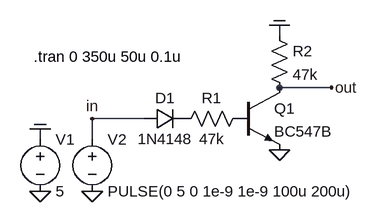
[diagram p0: schematic dtl1.asc]
dtl1.asc, the LTspice schematic file:
Version 4
SHEET 1 880 680
WIRE 464 16 464 0
WIRE 544 96 464 96
WIRE 256 144 176 144
WIRE 96 176 96 160
WIRE 176 176 176 144
FLAG 96 256 0
FLAG 96 160 COM
FLAG 464 192 0
FLAG 176 256 0
FLAG 464 0 COM
FLAG 544 96 out
FLAG 176 144 in
SYMBOL voltage 96 160 R0
WINDOW 123 0 0 Left 2
WINDOW 39 0 0 Left 2
SYMATTR InstName V1
SYMATTR Value 5
SYMBOL diode 256 160 R270
WINDOW 0 32 32 VTop 2
WINDOW 3 0 32 VBottom 2
SYMATTR InstName D1
SYMATTR Value 1N4148
SYMBOL res 416 128 R90
WINDOW 0 0 56 VBottom 2
WINDOW 3 32 56 VTop 2
SYMATTR InstName R1
SYMATTR Value 47k
SYMBOL npn 400 96 R0
SYMATTR InstName Q1
SYMATTR Value BC547B
SYMBOL res 448 0 R0
SYMATTR InstName R2
SYMATTR Value 47k
SYMBOL voltage 176 160 R0
WINDOW 123 0 0 Left 2
WINDOW 39 0 0 Left 2
SYMATTR InstName V2
SYMATTR Value PULSE(0 5 0 1e-9 1e-9 100u 200u)
TEXT 86 48 Left 2 !.tran 0 350u 50u 0.1u

The netlist it stands for:
* dtl1.asc
V1 COM 0 5
D1 in P001 1N4148
R1 P002 P001 47k
Q1 out P002 0 0 BC547B
R2 COM out 47k
V2 in 0 PULSE(0 5 0 1e-9 1e-9 100u 200u)
.model D D
.lib standard.dio
.model NPN NPN
.model PNP PNP
.lib standard.bjt
.tran 0 350u 50u 0.1u
.backanno
.end